# EAGLE design Netzteil_15V (EAGLE 7.2.0)
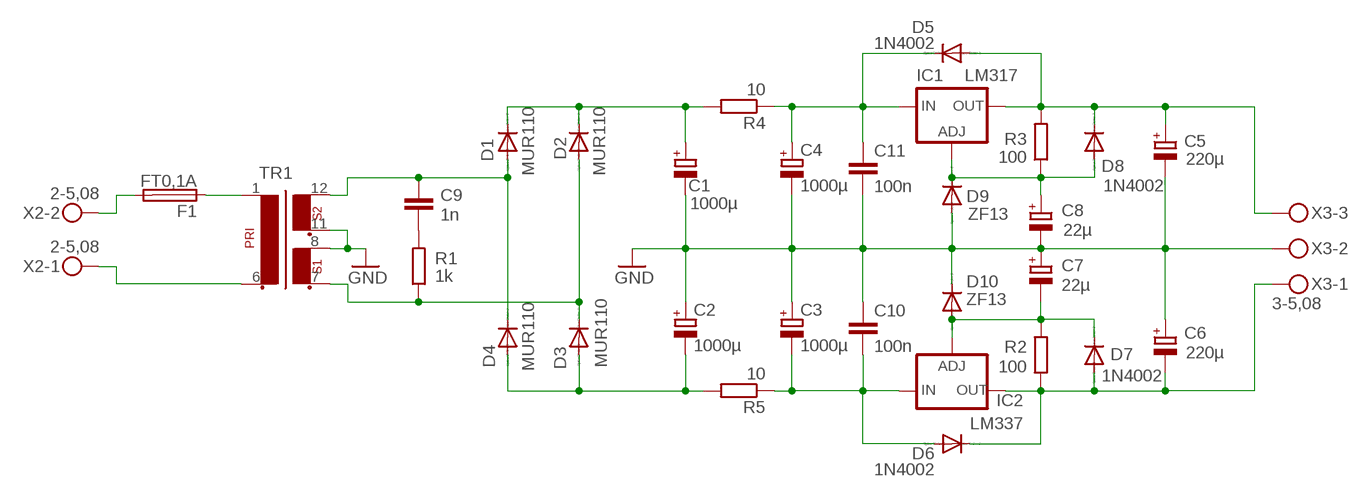
[diagram p0: schematic, sheet 1]

## Parts
C1  1000µ  CPOL-EUE5-13  [E5-13]
C2  1000µ  CPOL-EUE5-13  [E5-13]
C3  1000µ  CPOL-EUE5-13  [E5-13]
C4  1000µ  CPOL-EUE5-13  [E5-13]
C5  220µ  CPOL-EUE3.5-8  [E3,5-8]
C6  220µ  CPOL-EUE3.5-8  [E3,5-8]
C7  22µ  CPOL-EUE2-5  [E2-5]
C8  22µ  CPOL-EUE2-5  [E2-5]
C9  1n  C-EU050-045X075  [C050-045X075]
C10  100n  C-EU050-025X075  [C050-025X075]
C11  100n  C-EU050-025X075  [C050-025X075]
D1  MUR110  MUR150RL  [DO41-10]
D2  MUR110  MUR150RL  [DO41-10]
D3  MUR110  MUR150RL  [DO41-10]
D4  MUR110  MUR150RL  [DO41-10]
D5  1N4002  MUR150RL  [DO41-10]
D6  1N4002  MUR150RL  [DO41-10]
D7  1N4002  MUR150RL  [DO41-10]
D8  1N4002  MUR150RL  [DO41-10]
D9  ZF13  1N4148DO35-7  [DO35-7]
D10  ZF13  1N4148DO35-7  [DO35-7]
F1  FT0,1A  FUSE19560  [19560]
IC1  LM317  LM317TS  [317TS]
IC2  LM337  LM337TS  [337TS]
R1  1k  R-EU_0207/10  [0207/10]
R2  100  R-EU_0207/10  [0207/10]
R3  100  R-EU_0207/10  [0207/10]
R4  10  R-EU_0617/5V  [0617V]
R5  10  R-EU_0617/5V  [0617V]
TR1  EI48-2  [EI48-2]
X2  2-5,08  MKDSN1,5/2-5,08  [MKDSN1,5/2-5,08]
X3  3-5,08  MKDSN1,5/3-5,08  [MKDSN1,5/3-5,08]

## Nets
GND: C1.- C2.+ C3.+ C4.- C5.- C6.+ C7.+ C8.- C10.1 C11.2 D9.A D10.C TR1.8 TR1.11 X3.2
N$1: F1.2 X2.2
N$2: F1.1 TR1.1
N$3: TR1.6 X2.1
N$5: C9.2 R1.2
N$6: C9.1 D1.A D4.C TR1.12
N$7: D2.A D3.C R1.1 TR1.7
N$9: C1.+ D1.C D2.C R4.2
N$10: C2.- D3.A D4.A R5.2
N$11: C3.- C10.2 D6.A IC2.2(IN) R5.1
N$12: C4.+ C11.1 D5.C IC1.3(IN) R4.1
N$14: C8.+ D8.A D9.C IC1.1(ADJ) R3.1
N$15: C7.- D7.C D10.A IC2.1(ADJ) R2.2
N$16: C6.- D6.C D7.A IC2.3(OUT) R2.1 X3.1
N$19: C5.+ D5.A D8.C IC1.2(OUT) R3.2 X3.3

## Library data of the parts
C1-C8 = rcl:CPOL-EU: POLARIZED CAPACITOR, European symbol
C9-C11 = resistor:C-EU: CAPACITOR, European symbol
D1-D8 = diode:MUR150RL: DIODE
D9 D10 = diode:1N4148: DIODE high speed (Philips)
F1 = fuse:FUSE: Fuse; MPN: 56000001009; OC_FARNELL: 1185363; OC_NEWARK: 98K6125
IC1 = v-reg:LM317TS: VOLTAGE REGULATOR
IC2 = v-reg:LM337TS: VOLTAGE REGULATOR
R1-R5 = resistor:R-EU_: RESISTOR, European symbol
TR1 = trafo:EI48-2: TRANSFORMER 1 primary winding, 2 secondary windings ERA
X2 = con-phoenix-508:MKDSN1,5/2-5,08: MKDSN 1,5/ 2-5,08 Printklemme Nennstrom: 13,5 A Nennspannung: 250 V Rastermaß: 5,08 mm Polzahl: 2 Anschlussart: Schraubanschluss Montage: Löten Anschlussrichtung Leiter/Platine: 0 ° Artikelnummer: 1729128 Source: http://eshop.phoenixcontact.com .. 1729128.pdf
X3 = con-phoenix-508:MKDSN1,5/3-5,08: MKDSN 1,5/ 3-5,08 Printklemme Nennstrom: 13,5 A Nennspannung: 250 V Rastermaß: 5,08 mm Polzahl: 3 Anschlussart: Schraubanschluss Montage: Löten Anschlussrichtung Leiter/Platine: 0 ° Artikelnummer: 1729131 Source: http://eshop.phoenixcontact.com .. 1729131.pdf

## Board
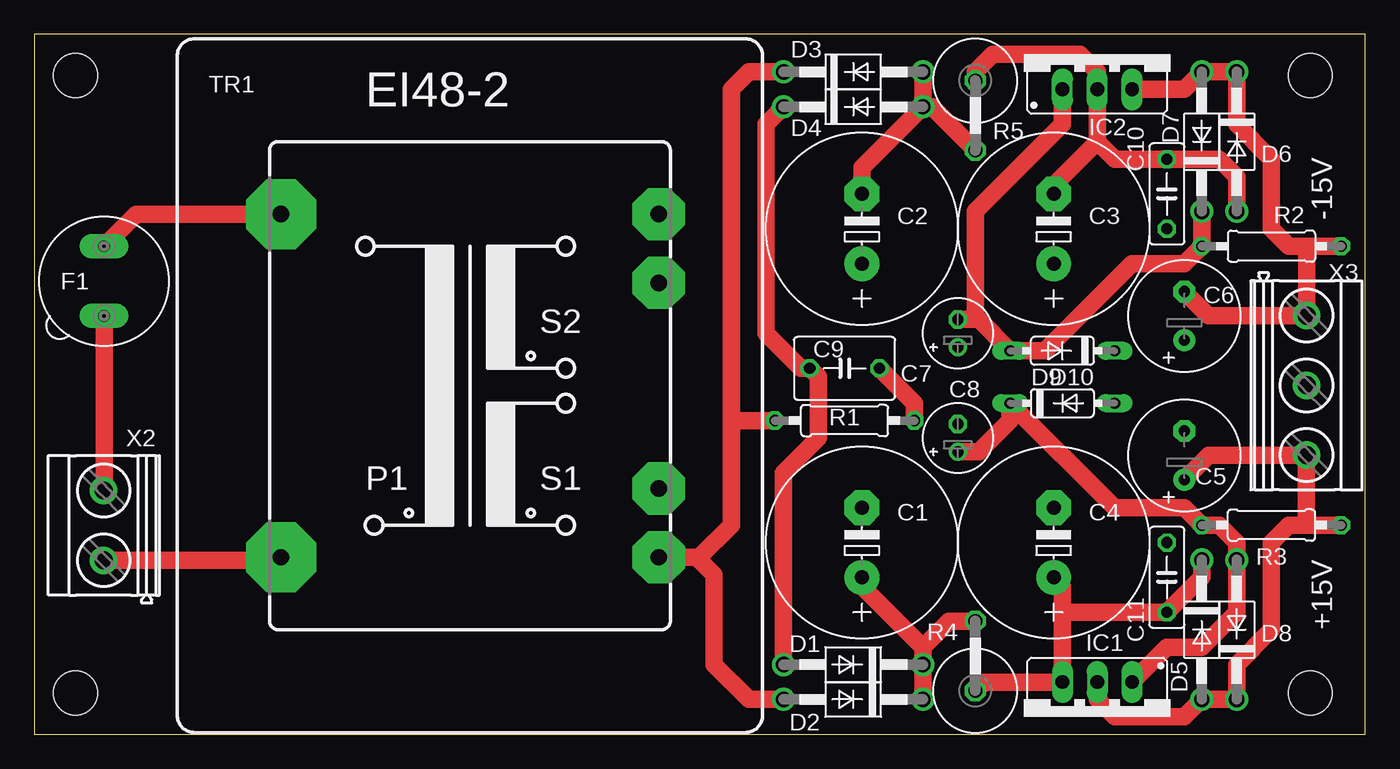
[diagram p1: board, top side]
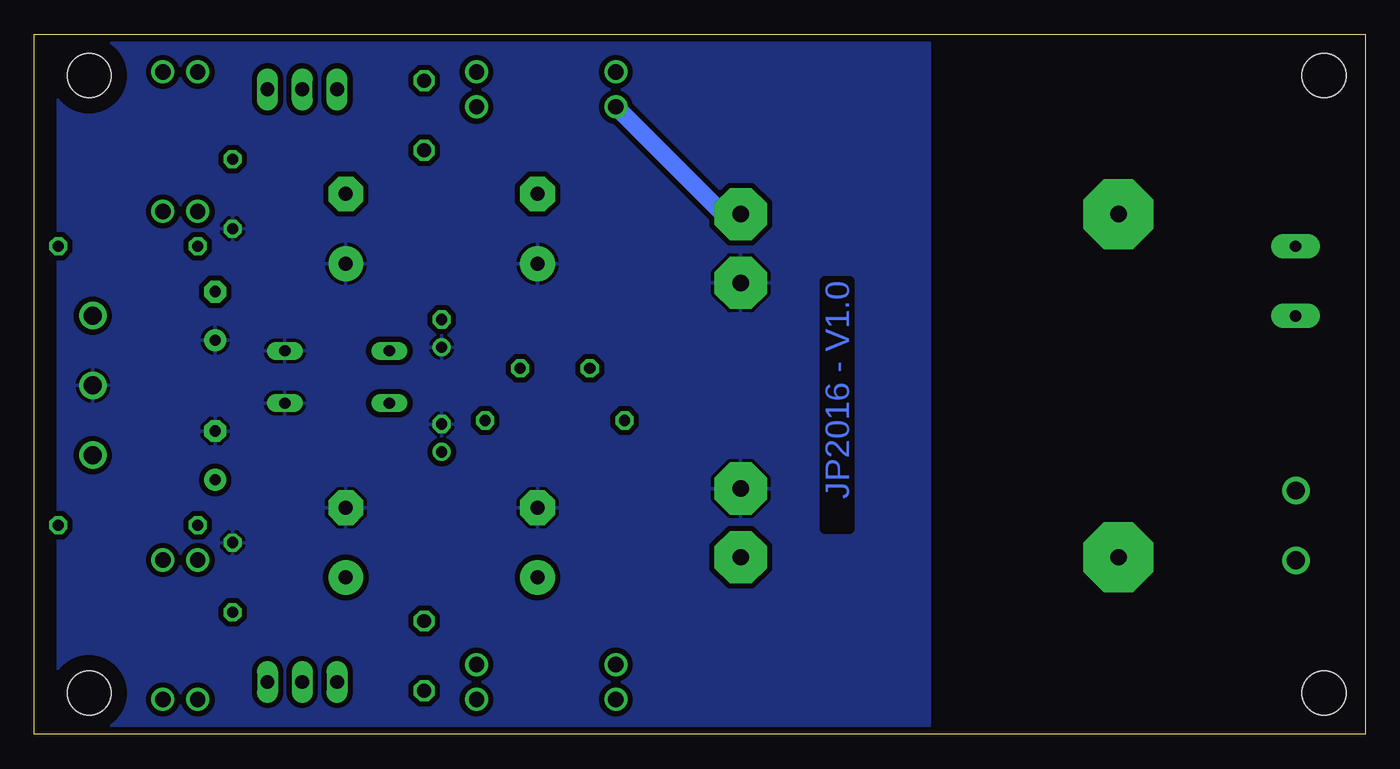
[diagram p2: board, bottom side, seen from below]

Size 97 x 51 mm. Coordinates in mm from the lower left corner, seen from the top.
Outline: 0,0 97,0 97,51 0,51 0,0
Copper layers (1*16): Top 0.035mm / dielectric 1.5mm / Bottom 0.035mm
Design rules "EagleRules *": minimum track width 7mil, minimum drill 12mil, track to track 15mil, track to pad 10mil, pad to pad 7mil, via to via 7mil, smd to smd 0mil, copper to edge 20mil, drill to drill 10mil, minimum pad ring 10mil, minimum via ring 6mil, stop-mask expansion 2mil, vias tented up to drill 25mil, thermal gap 10mil
Holes 3.2 mm at 3,3 3,48 93,48 93,3
bRestrict: area 0.2,45.2 to 5.8,50.8; area 90.2,45.2 to 95.8,50.8; area 90.2,0.2 to 95.8,5.8; area 0.2,0.2 to 5.8,5.8

### Footprints (pad centres in the part's own frame; a part is rotated, then mirrored left to right if it is on the bottom)
E5-13 = drill 1.016 pad 2.54: + -2.54,0 | drill 1.016 pad 2.54 octagon: - 2.54,0
E3,5-8 = drill 0.813 pad 1.6: + -1.778,0 | drill 0.813 pad 1.6 octagon: - 1.778,0
E2-5 = drill 0.813 pad 1.27: + -1.016,0 | drill 0.813 pad 1.27 octagon: - 1.016,0
C050-045X075 = drill 0.813 octagon: 1 -2.54,0; 2 2.54,0
C050-025X075 = drill 0.813 octagon: 1 -2.54,0; 2 2.54,0
DO41-10 = drill 1.118: A 5.08,0; C -5.08,0
DO35-7 = drill 0.813 long: A 3.81,0; C -3.81,0
19560 = drill 0.813 pad 1.778 long: 1 -2.54,0; 2 2.54,0
317TS = drill 1.016 long: 1 -2.54,-2.54; 2 0,-2.54; 3 2.54,-2.54
337TS = drill 1.016 long: 1 -2.54,-2.54; 2 0,-2.54; 3 2.54,-2.54
0207/10 = drill 0.813 octagon: 1 -5.08,0; 2 5.08,0
0617V = drill 1.016 octagon: 1 -2.54,0; 2 2.54,0
EI48-2 = drill 1.194 pad 5.08 octagon: 1 -13.767,12.497; 6 -13.767,-12.497 | drill 1.194 pad 3.81 octagon: 7 13.767,-12.497; 8 13.767,-7.493; 11 13.767,7.493; 12 13.767,12.497
MKDSN1,5/2-5,08 = drill 1.3 pad 2: 1 -2.561,0.025; 2 2.519,0.025
MKDSN1,5/3-5,08 = drill 1.3 pad 2: 1 -7.641,0.025; 2 -2.561,0.025; 3 2.519,0.025

### Placement (x,y rotation side)
C1  60.33,13.97 90 top
C2  60.33,36.83 90 top
C3  74.3,36.83 90 top
C4  74.3,13.97 90 top
C5  83.82,20.32 90 top
C6  83.82,30.48 90 top
C7  67.31,29.21 90 top
C8  67.31,21.59 90 top
C9  59.05,26.67 0 top
C10  82.55,39.37 90 top
C11  82.55,11.43 90 top
D1  59.69,5.08 180 top
D2  59.69,2.54 180 top
D3  59.69,48.26 0 top
D4  59.69,45.72 0 top
D5  85.09,7.62 270 top
D6  87.63,43.18 270 top
D7  85.09,43.18 90 top
D8  87.63,7.62 90 top
D9  74.93,24.13 0 top
D10  74.93,27.94 180 top
F1  5.08,33.02 270 top
IC1  77.47,1.27 180 top
IC2  77.47,49.53 0 top
R1  59.05,22.86 0 top
R2  90.17,35.56 180 top
R3  90.17,15.24 0 top
R4  68.58,5.71 90 top
R5  68.58,45.09 270 top
TR1  31.75,25.4 0 top
X2  5.08,15.24 90 top
X3  92.71,22.86 270 top

### Tracks (layer width: path | path; a pad name or v marks a point on that pad's centre or on a via)
GND
  pour Bottom: 31.75,50.8 95.25,50.8 95.25,40.64 95.25,0 31.75,0 31.75,2.54
N$1
  Top 1.27: F1.2 5.08,17.78 X2.2
N$2
  Top 1.27: TR1.1 7.42,37.9 F1.1
N$3
  Top 1.27: X2.1 17.76,12.68 TR1.6
N$5
  Top 1.27: R1.2 64.14,24.13 C9.2
N$6
  Top 1.27: D4.C 53.34,44.45 53.34,29.21 55.88,26.67 C9.1 57.15,26.04 57.15,21.59 54.61,19.05 D1.A
  Bottom 1.27: TR1.12 46.79,37.9 D4.C
N$7
  Top 1.27: TR1.7 48.26,12.9 | 48.26,12.9 48.46,12.9 50.8,15.24 50.8,22.86 | 50.8,22.86 50.8,46.99 52.07,48.26 D3.C | R1.1 50.8,22.86 | D2.A 52.07,2.54 49.53,5.08 49.53,11.63 48.26,12.9
N$9
  Top 1.27: D2.C D1.C 64.77,6.35 | C1.+ 60.33,10.79 64.77,6.35 | R4.2 66.67,8.26 64.77,6.35
N$10
  Top 1.27: D3.A D4.A | C2.- 60.33,41.27 D4.A | D4.A 65.41,45.72 R5.2
N$11
  Top 1.27: R5.1 68.58,48.26 69.85,49.53 76.2,49.53 77.47,48.26 IC2.2 77.47,43.18 | C3.- 74.3,40.01 77.47,43.18 | 77.47,43.18 78.74,41.91 C10.2 86.36,41.91 87.63,40.64 D6.A
N$12
  Top 1.27: R4.1 69.22,3.81 IC1.3 74.93,8.89 | 74.93,8.89 74.93,10.79 C4.+ | D5.C 85.09,11.43 C11.1 74.93,8.89
N$14
  Top 1.27: C8.+ 68.83,20.57 71.12,22.86 D9.C 78.74,16.51 83.82,16.51 R3.1 86.36,15.24 87.63,13.97 D8.A 87.63,8.89 85.09,6.35 82.55,6.35 IC1.1
N$15
  Top 1.27: C7.- 68.58,30.23 | 68.58,30.23 68.83,30.23 D10.A 73.66,27.94 80.01,34.29 83.82,34.29 R2.2 D7.C | IC2.1 74.93,44.45 68.58,38.1 68.58,30.23
N$16
  Top 1.27: X3.1 85.58,30.5 C6.- | IC2.3 83.82,46.99 D7.A D6.C 87.63,44.45 90.17,41.91 90.17,36.83 91.44,35.56 92.71,35.56 | 92.71,30.53 X3.1 | R2.1 92.71,35.56 | X3.1 92.73,35.53 92.71,35.56
N$19
  Top 1.27: IC1.2 77.47,2.54 78.74,1.27 83.82,1.27 D5.A D8.C 87.63,5.08 90.17,7.62 90.17,13.97 91.44,15.24 R3.2 92.71,15.24 92.71,20.32 X3.3 85.62,20.34 C5.+

### Text on the board
Bottom: JP2016 - V1.0
tNames: -15V | +15V